# Altium schematic sheet main.SchDoc
size Tabloid; SheetNumber: 1; SheetTotal: 4; Page: Main
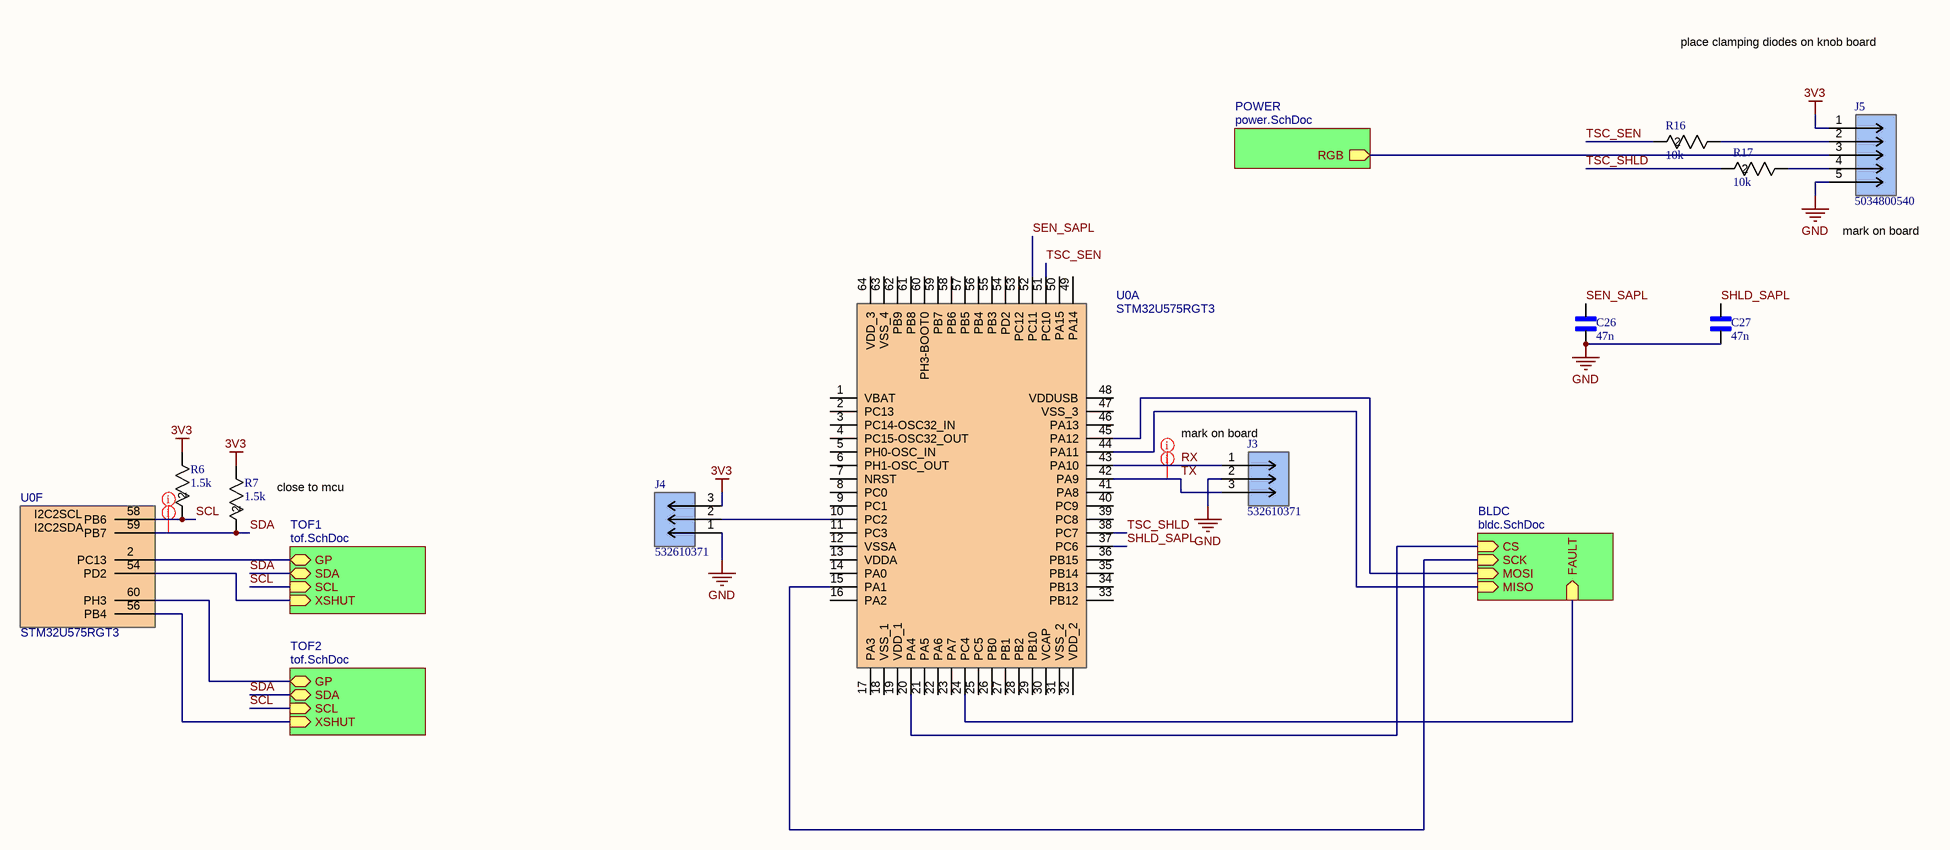
[diagram p0: main.SchDoc]

## Parts
(Parts that share a designator on the sheet are numbered #1, #2 ... from top to bottom, then left to right.)
C26  47n  [3216M/1206]
C27  47n  [3216M/1206]
J3  532610371  [CONN_532610001-SD_03_MOL]
J4  532610371  [CONN_532610001-SD_03_MOL]
J5  5034800540  [CONN_503480-0540_MOL]
R6  1.5k  [RC0603N_YAG]
R7  1.5k  [RC0603N_YAG]
R16  10k  [RESC1005X35N]
R17  10k  [RESC1005X35N]
U0#1  STM32U575RGT3  [QFP50P1200X1200X160-64N]  (part A of 7)
U0#2  STM32U575RGT3  [QFP50P1200X1200X160-64N]  (part F of 6)

## Sub-sheets
BLDC = bldc.SchDoc: MISO (in), MOSI (in), SCK (in), CS (in), FAULT (in)
POWER = power.SchDoc: RGB (out)
TOF1 = tof.SchDoc: GP (bidir), SDA (bidir), SCL (in), XSHUT (in)
TOF2 = tof.SchDoc: GP (bidir), SDA (bidir), SCL (in), XSHUT (in)

## Nets
3V3: J4.3 J5.1 R6.1 R7.1
GND: C26.1 C27.1 J3.2 J4.1 J5.5
RX: J3.1 U0#1.43(PA10)
SCL: R6.2 U0#2.58(PB6) ; sheet TOF1/SCL, sheet TOF2/SCL
SDA: R7.2 U0#2.59(PB7) ; sheet TOF1/SDA, sheet TOF2/SDA
SEN_SAPL: C26.2 U0#1.52(PC11)
SHLD_SAPL: C27.2 U0#1.37(PC6)
TSC_SEN: R16.2 U0#1.51(PC10)
TSC_SHLD: R17.2 U0#1.38(PC7)
TX: J3.3 U0#1.42(PA9)
NetJ4_2: J4.2 U0#1.10(PC2)
NetJ5_2: J5.2 R16.1
NetJ5_3: J5.3 ; sheet POWER/RGB
NetJ5_4: J5.4 R17.1
NetU0#1_15: U0#1.15(PA1) ; sheet BLDC/SCK
NetU0#1_20: U0#1.20(PA4) ; sheet BLDC/CS
NetU0#1_24: U0#1.24(PC4) ; sheet BLDC/FAULT
NetU0#1_44: U0#1.44(PA11) ; sheet BLDC/MISO
NetU0#1_45: U0#1.45(PA12) ; sheet BLDC/MOSI
NetU0#2_2: U0#2.2(PC13) ; sheet TOF1/GP
NetU0#2_54: U0#2.54(PD2) ; sheet TOF1/XSHUT
NetU0#2_56: U0#2.56(PB4) ; sheet TOF2/XSHUT
NetU0#2_60: U0#2.60(PH3) ; sheet TOF2/GP

Not connected (* = marked no-connect by the designer): U0#1 1(VBAT) 2(PC13) 3(PC14-OSC32_IN) 4(PC15-OSC32_OUT) 5(PH0-OSC_IN) 6(PH1-OSC_OUT) 7(NRST) 8(PC0) 9(PC1) 11(PC3) 12(VSSA) 13(VDDA) 14(PA0) 16(PA2) 17(PA3) 18(VSS_1) 19(VDD_1) 21(PA5) 22(PA6) 23(PA7) 25(PC5) 26(PB0) 27(PB1) 28(PB2) 29(PB10) 30(VCAP) 31(VSS_2) 32(VDD_2) 33(PB12) 34(PB13) 35(PB14) 36(PB15) 39(PC8) 40(PC9) 41(PA8) 46(PA13) 47(VSS_3) 48(VDDUSB) 49(PA14) 50(PA15) 53(PC12) 54(PD2) 55(PB3) 56(PB4) 57(PB5) 58(PB6) 59(PB7) 60(PH3-BOOT0) 61(PB8) 62(PB9) 63(VSS_4) 64(VDD_3)

## Layout directives
net class usart: RX, TX
net class i2c2: SCL, SDA

## Notes on the sheet
- place clamping diodes on knob board
- (near J5) mark on board
- (near J3) mark on board
- (near R7) close to mcu
- Board
- Page
- Author
- Date:
- File:
- (in symbol STM32U575RGT3, part F) I2C2SCL; I2C2SDA

## Library data of the parts
C26 C27 = GRM3195C2A473GA: CAP CER 47NF 100V C0G 1206; MF: {'manufacturer': u'Taiyo Yuden'}; Package: None; Price: None; Value: *; MP: GRM3195C2A473GA; Availability: Unavailable; Manufacturer_Part_Number: GRM3195C2A473GA
J3 J4 = 532610371: 1.25mm Pitch, PicoBlade PCB Header, Single Row, Right-Angle, Surface Mount, Tin (Sn) Plating, Friction Lock, 3 Circuits, Natural, Tape and Reel; Manufacturer_Name: Molex Connector Corporation; Copyright: Copyright (C) 2025 Ultra Librarian. All rights reserved.; Manufacturer_Part_Number: 532610371; RefDes: RefDes; Type: Type
J5 = 5034800540: Easy-On FFC/FPC Connector, 0.50mm Pitch, FBH1 Series, Right-Angle, Dual Contact, 1.00mm Height, 5 Circuits, Gold over Nickel Plating; Manufacturer_Name: Molex Connector Corporation; Copyright: Copyright (C) 2025 Ultra Librarian. All rights reserved.; Manufacturer_Part_Number: 5034800540; RefDes: RefDes; Type: Type
R6 R7 = RC0603FR-071K5L: 1.5K OHM 1% 1/10W 0603; Manufacturer_Name: Yageo; Copyright: Copyright (C) 2026 Ultra Librarian. All rights reserved.; Manufacturer_Part_Number: RC0603FR-071K5L
R16 R17 = RT0402BRD0710KL: 10K OHM 0.1% 1/10W 0402; Manufacturer_Name: Yageo; Copyright: Copyright (C) 2026 Ultra Librarian. All rights reserved.; Manufacturer_Part_Number: RT0402BRD0710KL
U0#1 U0#2 = STM32U575RGT3: Ultra-low-power Arm Cortex-M33 32-bit MCU+TrustZone+FPU, 240 DMIPS, up to 2 MB Flash memory, 786 KB SRAM; Manufacturer_Name: STMicroelectronics; Geometry.Height: 1.6mm; Manufacturer_Part_Number: STM32U575RGT3; Mouser Part Number: *; Mouser Price/Stock: *; Arrow Part Number: *; Arrow Price/Stock: *; Datasheet Link: https://www.st.com/resource/en/datasheet/stm32u575ag.pdf